# Altium schematic sheet 04_InterfaceSensor.SchDoc
size A4; SheetNumber: 4; SheetTotal: 6
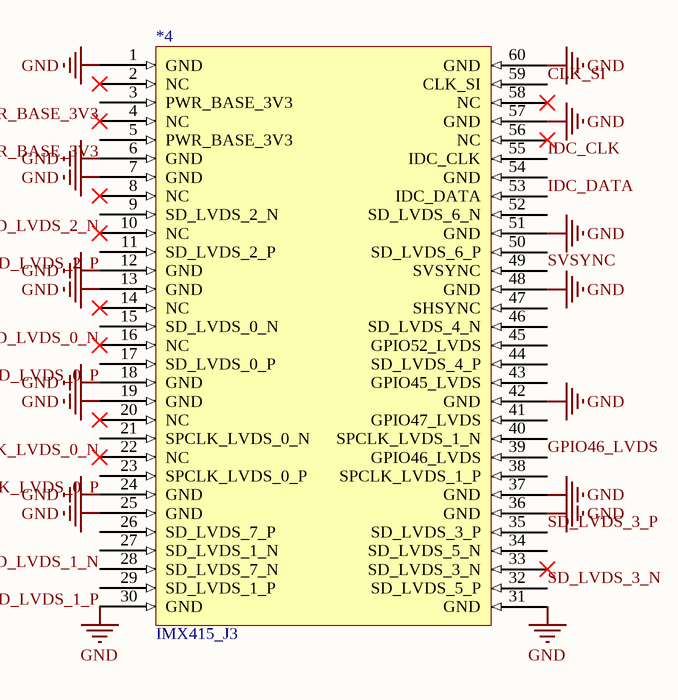
[diagram p0: 04_InterfaceSensor.SchDoc]

## Parts
*4  IMX415_J3  [HRS_DF40HC(4.0)-60DS-0.4V(51)]

## Nets
GND: *4.1(GND) *4.6(GND) *4.7(GND) *4.12(GND) *4.13(GND) *4.18(GND) *4.19(GND) *4.24(GND) *4.25(GND) *4.30(GND) *4.31(GND) *4.36(GND) *4.37(GND) *4.42(GND) *4.48(GND) *4.51(GND) *4.57(GND) *4.60(GND)
CLK_SI: *4.59(CLK_SI)
GPIO46_LVDS: *4.39(GPIO46_LVDS)
IDC_CLK: *4.55(IDC_CLK)
IDC_DATA: *4.53(IDC_DATA)
PWR_BASE_3V3: *4.3(PWR_BASE_3V3) *4.5(PWR_BASE_3V3)
SD_LVDS_0_N: *4.15(SD_LVDS_0_N)
SD_LVDS_0_P: *4.17(SD_LVDS_0_P)
SD_LVDS_1_N: *4.27(SD_LVDS_1_N)
SD_LVDS_1_P: *4.29(SD_LVDS_1_P)
SD_LVDS_2_N: *4.9(SD_LVDS_2_N)
SD_LVDS_2_P: *4.11(SD_LVDS_2_P)
SD_LVDS_3_N: *4.32(SD_LVDS_5_P)
SD_LVDS_3_P: *4.35(SD_LVDS_3_P)
SPCLK_LVDS_0_N: *4.21(SPCLK_LVDS_0_N)
SPCLK_LVDS_0_P: *4.23(SPCLK_LVDS_0_P)
SVSYNC: *4.49(SVSYNC)

Not connected (* = marked no-connect by the designer): *4 2(NC)* 4(NC)* 8(NC)* 10(NC)* 14(NC)* 16(NC)* 20(NC)* 22(NC)* 26(SD_LVDS_7_P) 28(SD_LVDS_7_N) 33(SD_LVDS_3_N)* 34(SD_LVDS_5_N) 38(SPCLK_LVDS_1_P) 40(SPCLK_LVDS_1_N) 41(GPIO47_LVDS) 43(GPIO45_LVDS) 44(SD_LVDS_4_P) 45(GPIO52_LVDS) 46(SD_LVDS_4_N) 47(SHSYNC) 50(SD_LVDS_6_P) 52(SD_LVDS_6_N) 54(GND) 56(NC)* 58(NC)*